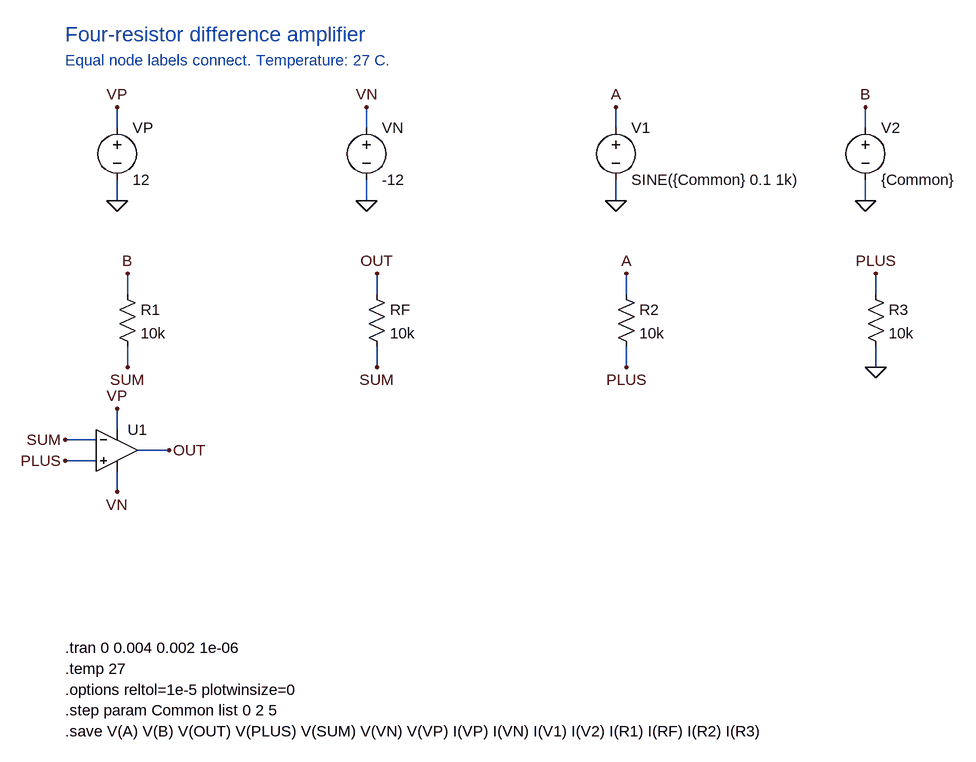
[diagram p0: schematic opamp-difference.asc]
opamp-difference.asc, the LTspice schematic file:
Version 4
SHEET 1 1740 1256
WIRE 144 176 144 144
WIRE 144 256 144 288
WIRE 528 176 528 144
WIRE 528 256 528 288
WIRE 912 176 912 144
WIRE 912 256 912 288
WIRE 1296 176 1296 144
WIRE 1296 256 1296 288
WIRE 160 432 160 400
WIRE 160 512 160 544
WIRE 544 432 544 400
WIRE 544 512 544 544
WIRE 928 432 928 400
WIRE 928 512 928 544
WIRE 1312 432 1312 400
WIRE 1312 512 1312 544
WIRE 112 688 64 688
WIRE 112 656 64 656
WIRE 144 640 144 608
WIRE 144 704 144 736
WIRE 176 672 224 672
FLAG 144 144 VP
FLAG 144 288 0
FLAG 528 144 VN
FLAG 528 288 0
FLAG 912 144 A
FLAG 912 288 0
FLAG 1296 144 B
FLAG 1296 288 0
FLAG 160 400 B
FLAG 160 544 SUM
FLAG 544 400 OUT
FLAG 544 544 SUM
FLAG 928 400 A
FLAG 928 544 PLUS
FLAG 1312 400 PLUS
FLAG 1312 544 0
FLAG 64 688 PLUS
FLAG 64 656 SUM
FLAG 144 608 VP
FLAG 144 736 VN
FLAG 224 672 OUT
SYMBOL voltage 144 160 R0
SYMATTR InstName VP
SYMATTR Value 12
SYMBOL voltage 528 160 R0
SYMATTR InstName VN
SYMATTR Value -12
SYMBOL voltage 912 160 R0
SYMATTR InstName V1
SYMATTR Value SINE({Common} 0.1 1k)
SYMBOL voltage 1296 160 R0
SYMATTR InstName V2
SYMATTR Value {Common}
SYMBOL res 144 416 R0
SYMATTR InstName R1
SYMATTR Value 10k
SYMBOL res 528 416 R0
SYMATTR InstName RF
SYMATTR Value 10k
SYMBOL res 912 416 R0
SYMATTR InstName R2
SYMATTR Value 10k
SYMBOL res 1296 416 R0
SYMATTR InstName R3
SYMATTR Value 10k
SYMBOL OpAmps/UniversalOpamp2 144 672 R0
SYMATTR InstName U1
SYMATTR SpiceModel level2
SYMATTR Value2 Avol=1Meg GBW=10Meg Slew=10Meg
SYMATTR SpiceLine Ilimit=100m Rail=0.5 Vos=0
SYMATTR SpiceLine2 En=0 Enk=0 In=0 Ink=0 Rin=1G
TEXT 64 32 Left 3 ;Four-resistor difference amplifier
TEXT 64 72 Left 2 ;Equal node labels connect. Temperature: 27 C.
TEXT 64 976 Left 2 !.tran 0 0.004 0.002 1e-06
TEXT 64 1008 Left 2 !.temp 27
TEXT 64 1040 Left 2 !.options reltol=1e-5 plotwinsize=0
TEXT 64 1072 Left 2 !.step param Common list 0 2 5
TEXT 64 1104 Left 2 !.save V(A) V(B) V(OUT) V(PLUS) V(SUM) V(VN) V(VP) I(VP) I(VN) I(V1) I(V2) I(R1) I(RF) I(R2) I(R3)

The netlist it stands for:
* opamp-difference.asc
VP VP 0 12
VN VN 0 -12
V1 A 0 SINE({Common} 0.1 1k)
V2 B 0 {Common}
R1 B SUM 10k
RF OUT SUM 10k
R2 A PLUS 10k
R3 PLUS 0 10k
XU1 PLUS SUM VP VN OUT level2 Avol=1Meg GBW=10Meg Slew=10Meg Ilimit=100m Rail=0.5 Vos=0 En=0 Enk=0 In=0 Ink=0 Rin=1G  ; pins In+ In- V+ V- OUT
* Four-resistor difference amplifier
* Equal node labels connect. Temperature: 27 C.
.tran 0 0.004 0.002 1e-06
.temp 27
.options reltol=1e-5 plotwinsize=0
.step param Common list 0 2 5
.save V(A) V(B) V(OUT) V(PLUS) V(SUM) V(VN) V(VP) I(VP) I(VN) I(V1) I(V2) I(R1) I(RF) I(R2) I(R3)
.lib UniversalOpAmp2.lib
.backanno
.end